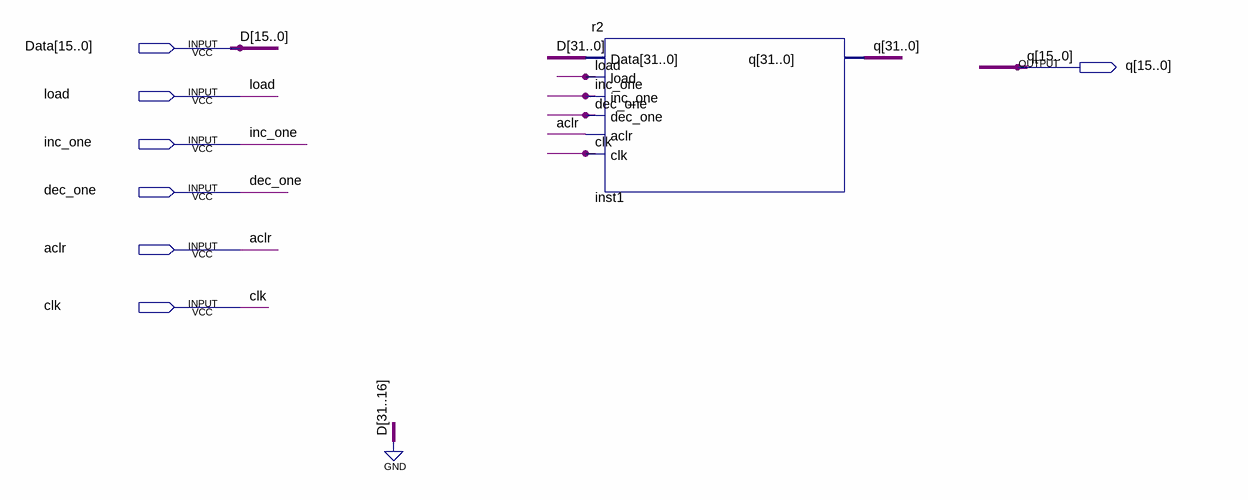
[diagram p0: schematic sheet]
// Quartus schematic r2_16bit.bdf as structural Verilog: 1 symbols, 7 pins
module r2_16bit (
  input  [15:0] Data,
  input  load,
  input  inc_one,
  input  dec_one,
  input  aclr,
  input  clk,
  output [31:0] q
);

  r2 inst1 (
    .Data({{16{1'b0}}, Data}), .load(load), .inc_one(inc_one), .dec_one(dec_one), .aclr(aclr), .clk(clk),
    .q(q));

  // Other names for the same wires on the sheet: D[15:0] = Data
endmodule
